# EAGLE design HamPreamp (EAGLE 5.11)
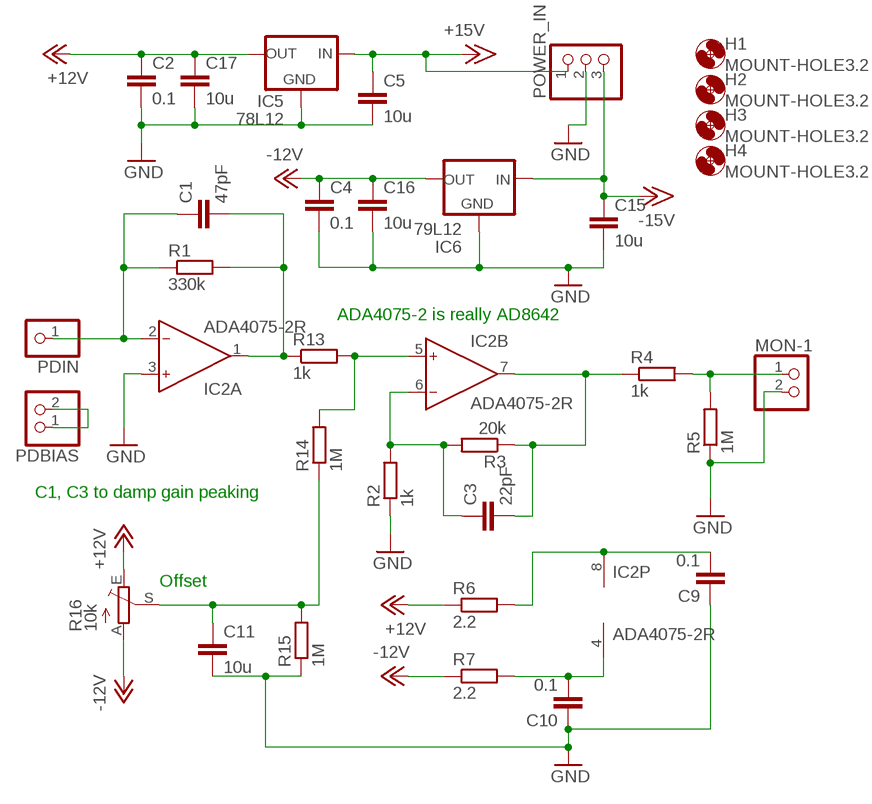
[diagram p0: schematic, sheet 1]

## Parts
C1  47pF  C-EUC0805  [C0805]
C2  0.1  C-EUC1206  [C1206]
C3  22pF  C-EUC0805  [C0805]
C4  0.1  C-EUC1206  [C1206]
C5  10u  C-EUC1206  [C1206]
C9  0.1  C-EUC0805  [C0805]
C10  0.1  C-EUC0805  [C0805]
C11  10u  C-EUC1206  [C1206]
C15  10u  C-EUC1206  [C1206]
C16  10u  C-EUC1206  [C1206]
C17  10u  C-EUC1206  [C1206]
H1  MOUNT-HOLE3.2  [3,2]
H2  MOUNT-HOLE3.2  [3,2]
H3  MOUNT-HOLE3.2  [3,2]
H4  MOUNT-HOLE3.2  [3,2]
IC2  ADA4075-2R  [SO8]
IC5  78L12  78LXX  [78LXX]
IC6  79L12  79LXX  [79LXX]
MON-1  PINHD-1X2  [1X02]
PDBIAS  PINHD-1X2  [1X02]
PDIN  PINHD-1X1  [1X01]
POWER_IN  PINHD-1X3  [1X03]
R1  330k  R-EU_R0805  [R0805]
R2  1k  R-EU_R0805  [R0805]
R3  20k  R-EU_R0805  [R0805]
R4  1k  R-EU_R0805  [R0805]
R5  1M  R-EU_R0805  [R0805]
R6  2.2  R-EU_R0805  [R0805]
R7  2.2  R-EU_R0805  [R0805]
R13  1k  R-EU_R0805  [R0805]
R14  1M  R-EU_R0805  [R0805]
R15  1M  R-EU_R0805  [R0805]
R16  10k  TRIM_EU-S63P  [S63P]

## Nets
+12V: C2.1 C17.1 IC5.OUT R6.1 R16.E
+15V: C5.1 IC5.IN POWER_IN.1
-12V: C4.1 C16.1 IC6.OUT R7.1 R16.A
-15V: C15.1 IC6.IN POWER_IN.3
GND: C2.2 C4.2 C5.2 C9.1 C10.1 C11.2 C15.2 C16.2 C17.2 IC2.3(A:IN+) IC5.GND IC6.GND MON-1.2 POWER_IN.2 R2.1 R5.1 R15.1
N$1: C1.1 IC2.2(A:IN-) PDIN.1 R1.1
N$2: C1.2 IC2.1(A:OUT) R1.2 R13.1
N$3: MON-1.1 R4.2 R5.2
N$4: C10.2 IC2.4(P:V-) R7.2
N$6: C9.2 IC2.8(P:V+) R6.2
N$7: C3.2 IC2.7(B:OUT) R3.1 R4.1
N$10: C11.1 R14.1 R15.2 R16.S
N$11: PDBIAS.1 PDBIAS.2
N$16: IC2.5(B:IN+) R13.2 R14.2
N$17: C3.1 IC2.6(B:IN-) R2.2 R3.2

## Notes on the sheet
- ADA4075-2 is really AD8642
- C1, C3 to damp gain peaking
- Offset

## Library data of the parts
C1-C5 C9-C11 C15-C17 = rcl:C-EU: CAPACITOR, European symbol
H1-H4 = holes:MOUNT-HOLE: MOUNTING HOLE with drill center marker
IC2 = analog-devices:ADA4075-2: Ultralow Noise Amplifier at Lower Power Source: http://www.analog.com/static/imported-files/data_sheets/ADA4075-2.pdf; MPN: ADA4075-2ARZ; OC_FARNELL: 1701254; OC_NEWARK: 19P8164
IC5 = v-reg:78LXX: VOLTAGE REGULATOR
IC6 = v-reg:79LXX: VOLTAGE REGULATOR
MON-1 PDBIAS = pinhead:PINHD-1X2: PIN HEADER
PDIN = pinhead:PINHD-1X1: PIN HEADER
POWER_IN = pinhead:PINHD-1X3: PIN HEADER
R1-R7 R13-R15 = rcl:R-EU_: RESISTOR, European symbol
R16 = pot:TRIM_EU-: POTENTIOMETER

## Board
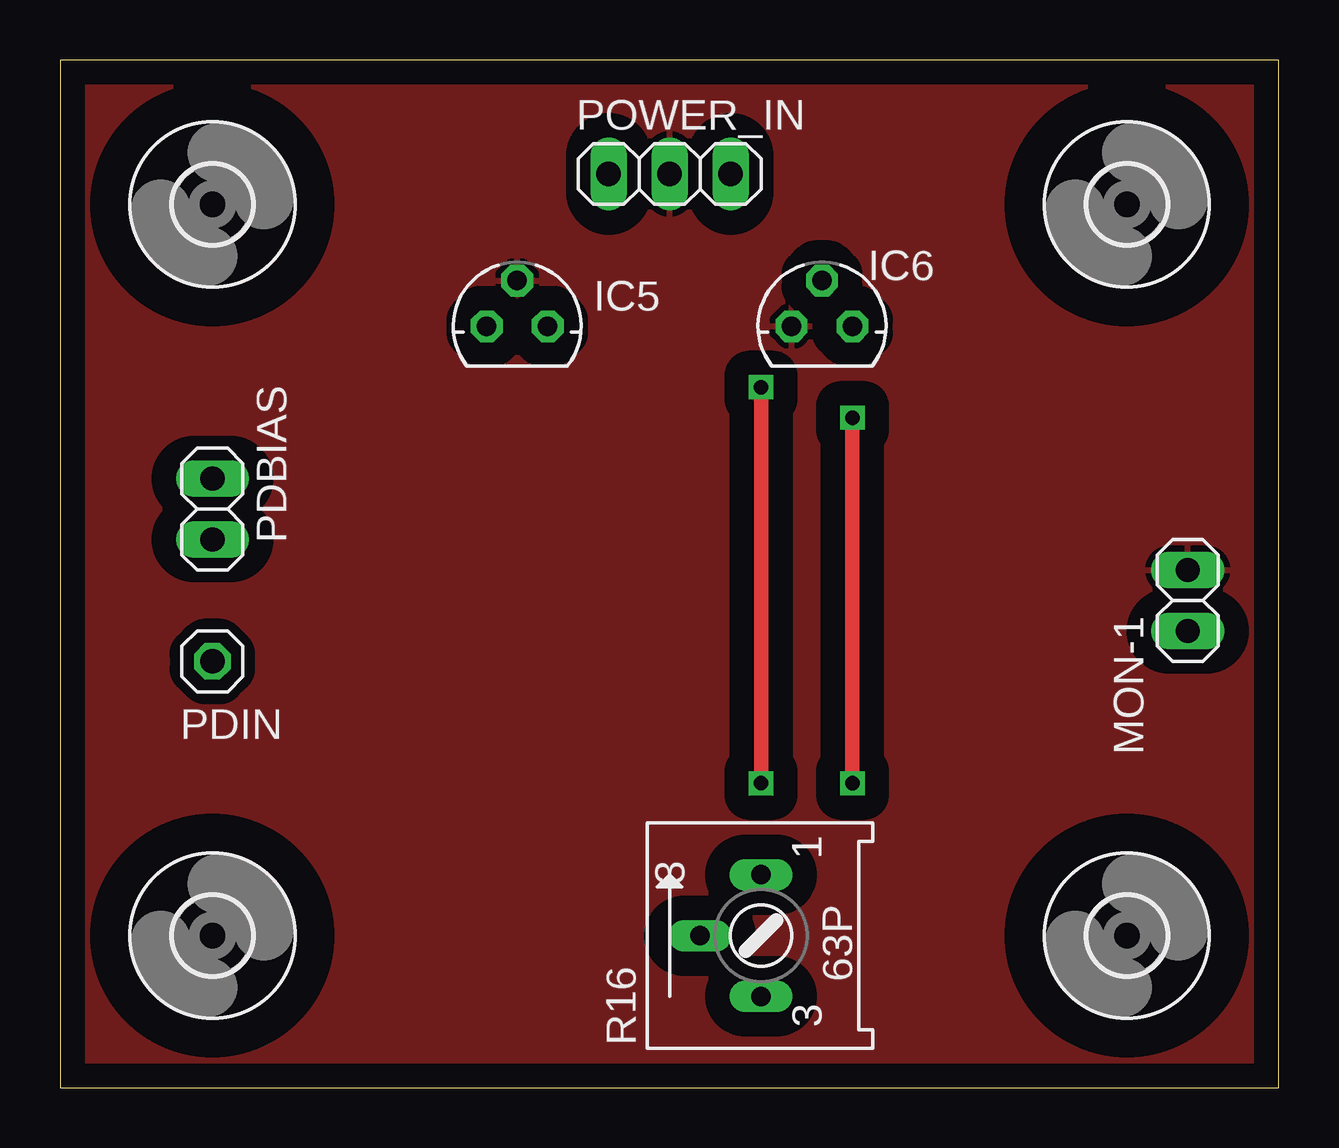
[diagram p1: board, top side]
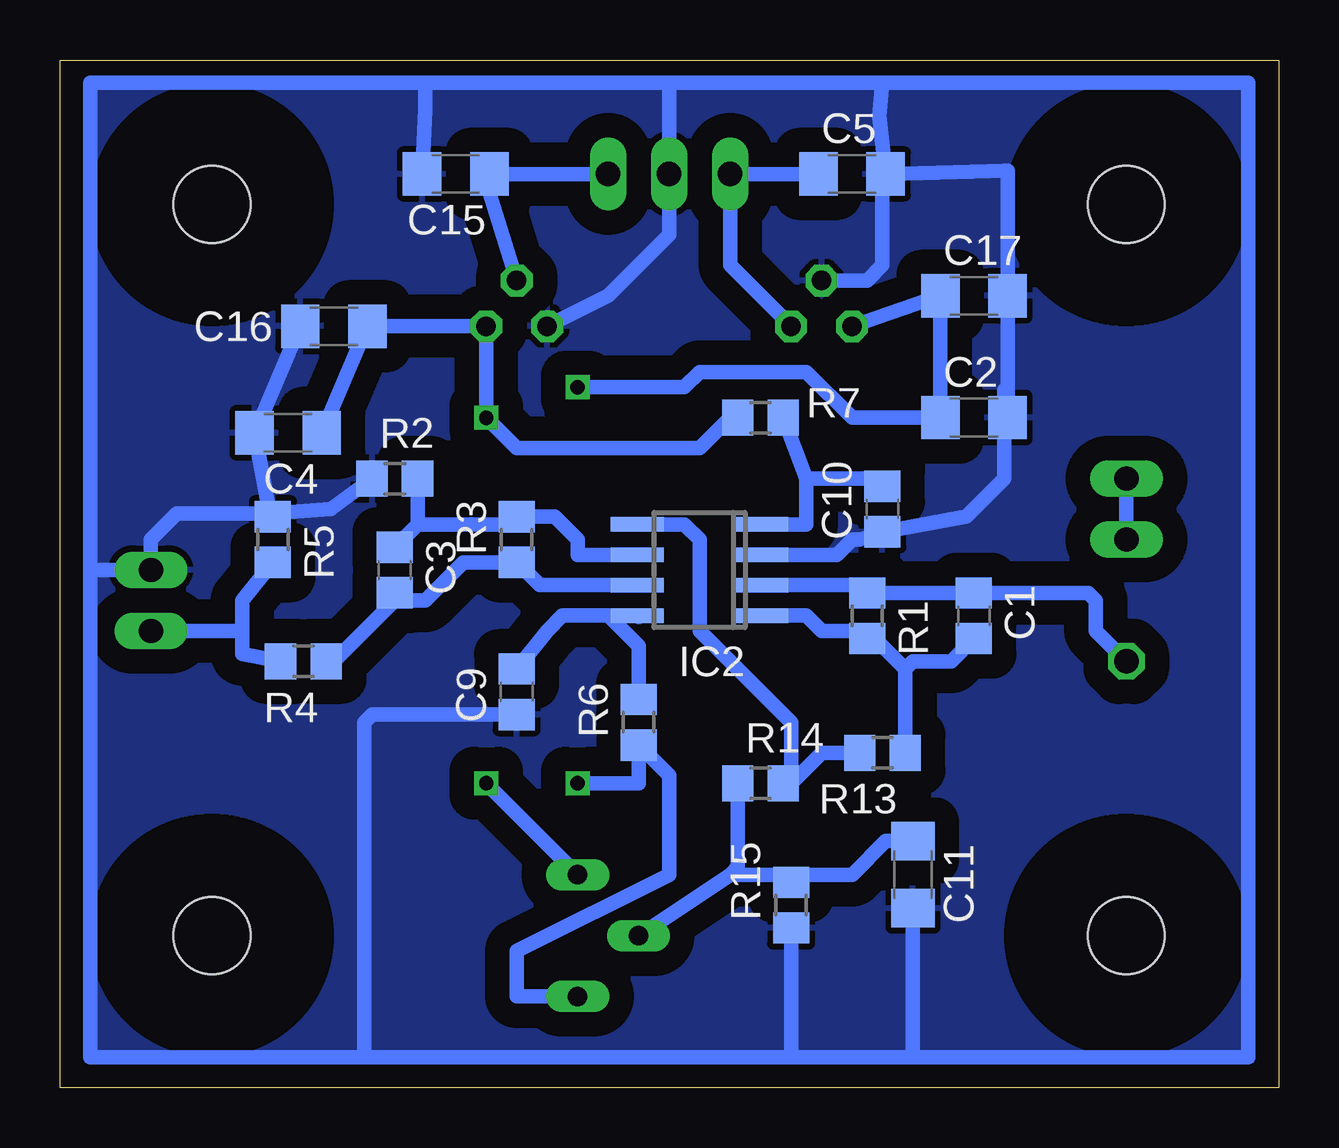
[diagram p2: board, bottom side, seen from below]

Size 50.78 x 42.85 mm. Coordinates in mm from the lower left corner, seen from the top.
Outline: 0,0 50.78,0 50.78,42.85 0,42.85 0,0
Copper layers (1*16): Top 0.035mm / dielectric 1.5mm / Bottom 0.035mm
Design rules "default": minimum track width 10mil, minimum drill 24mil, track to track 8mil, track to pad 8mil, pad to pad 8mil, via to via 8mil, smd to smd 8mil, copper to edge 40mil, drill to drill 8mil, minimum pad ring 10mil, minimum via ring 8mil, stop-mask expansion 4mil, vias tented up to drill 0mil, thermal gap 10mil

### Footprints (pad centres in the part's own frame; a part is rotated, then mirrored left to right if it is on the bottom)
C0805 = smd 1.3 x 1.5: 1 -0.95,0; 2 0.95,0
C1206 = smd 1.6 x 1.8: 1 -1.4,0; 2 1.4,0
3,2 = hole 3.2: 0,0
SO8 = smd 0.6 x 2.2: 1 -1.905,-2.6; 2 -0.635,-2.6; 3 0.635,-2.6; 4 1.905,-2.6; 5 1.905,2.6; 6 0.635,2.6; 7 -0.635,2.6; 8 -1.905,2.6
78LXX = drill 0.813 octagon: GND 0,1.905; IN 1.27,0; OUT -1.27,0
79LXX = drill 0.813 octagon: GND -1.27,0; IN 0,1.905; OUT 1.27,0
1X02 = drill 1.016 long: 1 -1.27,0; 2 1.27,0
1X01 = drill 1.016 octagon: 1 0,0
1X03 = drill 1.016 long: 1 -2.54,0; 2 0,0; 3 2.54,0
R0805 = smd 1.3 x 1.5: 1 -0.95,0; 2 0.95,0
S63P = drill 0.813 long: A 2.54,0; E -2.54,0; S 0,2.54

### Placement (x,y rotation side)
C1  12.7,19.68 270 bottom
C2  12.7,27.94 0 bottom
C3  36.83,21.59 270 bottom
C4  41.27,27.3 180 bottom
C5  17.78,38.1 0 bottom
C9  31.75,16.51 90 bottom
C10  16.51,24.13 90 bottom
C11  15.24,8.89 270 bottom
C15  34.29,38.1 180 bottom
C16  39.37,31.75 180 bottom
C17  12.7,33.02 0 bottom
H1  44.45,6.35 0 top
H2  44.45,36.83 0 top
H3  6.35,6.35 0 top
H4  6.35,36.83 0 top
IC2  24.13,21.59 90 bottom
IC5  19.05,31.75 0 top
IC6  31.75,31.75 0 top
MON-1  46.99,20.32 90 top
PDBIAS  6.35,24.13 270 top
PDIN  6.35,17.78 0 top
POWER_IN  25.4,38.1 0 top
R1  17.14,19.68 270 bottom
R2  36.83,25.4 0 bottom
R3  31.75,22.86 90 bottom
R4  40.64,17.78 180 bottom
R5  41.91,22.86 270 bottom
R6  26.67,15.24 90 bottom
R7  21.59,27.94 0 bottom
R13  16.51,13.97 180 bottom
R14  21.59,12.7 0 bottom
R15  20.32,7.62 90 bottom
R16  29.21,6.35 90 top

### Tracks (layer width: path | path; a pad name or v marks a point on that pad's centre or on a via)
+12V  (via drill 0.6)
  Top 0.61: v29.21,12.7 v29.21,29.21
  Bottom 0.61: IC5.OUT C17.1 C2.1 17.78,27.94 19.68,29.84 24.13,29.84 24.77,29.21 v29.21,29.21 | R16.E 31.75,3.81 31.75,5.71 25.4,8.89 25.4,13.02 R6.1 26.67,12.7 v29.21,12.7
+15V
  Bottom 0.61: IC5.IN 22.86,34.29 POWER_IN.1 C5.1
-12V  (via drill 0.6)
  Top 0.61: v33.02,12.7 v33.02,27.94
  Bottom 0.61: R16.A v33.02,12.7 | C4.1 C16.1 IC6.OUT v33.02,27.94 31.75,26.67 24.13,26.67 22.86,27.94 R7.1
-15V
  Bottom 0.61: POWER_IN.3 C15.1 32.89,37.34 IC6.IN
GND
  Bottom 0.61: 25.4,41.91 POWER_IN.2 25.4,35.56 27.94,33.02 IC6.GND | 16.51,41.91 1.27,41.91 1.27,1.27 15.24,1.27 | 16.51,41.91 25.4,41.91 | 15.24,1.27 C11.2 | 15.24,1.27 20.32,1.27 | 20.32,1.27 38.1,1.27 | 38.1,1.27 38.1,15.24 37.78,15.56 C9.1 | 38.1,1.27 49.53,1.27 49.53,21.59 | 49.53,21.59 MON-1.2 46.99,22.86 45.91,23.94 42.04,23.94 | 49.53,21.59 49.53,41.91 35.56,41.91 | 35.56,41.91 35.56,40.77 C15.2 | 25.4,41.91 35.56,41.91 | C5.2 16.64,40.51 16.51,41.91 | 20.32,1.27 R15.1 | IC2.3 18.41,22.23 17.78,22.86 17.46,22.86 C10.1 13.02,23.82 11.43,25.4 11.43,29.08 C2.2 C17.2 11.3,38.09 11.43,38.23 | C5.2 11.43,38.23 | 11.43,38.23 11.3,38.23 | 11.3,38.23 16.51,38.1 | 11.3,38.23 16.25,38.1 | C16.2 C4.2 42.04,23.94 | 42.04,23.94 39.5,24.13 R2.1 | IC5.GND 17.14,33.66 16.51,34.29 16.51,37.97 C5.2 | 42.04,23.94 R5.1
  pour Bottom (isolate 1.016): 0.64,0.64 0.64,42.55 50.16,42.55 50.16,0.64
  pour Top (isolate 1.016): 0.64,0.64 0.64,41.91 50.16,41.91 50.16,0.64
N$1
  Bottom 0.61: IC2.2 17.46,20.95 R1.1 C1.1 7.94,20.64 7.62,20.32 7.62,19.05 PDIN.1
N$2
  Bottom 0.61: IC2.1 19.68,19.68 19.05,19.05 17.46,19.05 R1.2 16.84,18.73 15.56,17.46 | R13.1 15.56,17.46 | 15.56,17.46 15.24,17.78 13.66,17.78 C1.2
N$3
  Bottom 0.61: R5.2 43.18,20.32 43.18,19.05 | 43.18,19.05 43.18,18.1 R4.2 | 43.18,19.05 MON-1.1
N$4
  Bottom 0.61: IC2.4 19.68,23.5 19.68,25.4 | 19.68,25.4 16.82,25.4 C10.2 | 19.68,25.4 R7.2
N$6
  Bottom 0.61: 27.94,19.68 IC2.8 26.67,19.62 | 27.94,19.68 29.84,19.68 30.48,19.05 C9.2 | R6.2 26.67,18.41 27.94,19.68
N$7
  Bottom 0.61: IC2.7 30.79,20.95 R3.1 33.97,21.91 35.56,20.32 36.51,20.32 C3.2 36.83,20.32 39.37,17.78 R4.1
N$10
  Bottom 0.61: C11.1 16.38,10.29 17.78,8.89 20,8.89 R15.2 20.64,8.89 22.86,8.89 | 22.86,8.89 R16.S | R14.1 22.54,9.21 22.86,8.89
N$11
  Bottom 0.61: PDBIAS.2 PDBIAS.1
N$16
  Bottom 0.61: R13.2 19.05,13.97 20.32,12.7 R14.2 20.32,13.02 20.32,15.24 24.13,19.05 24.13,22.86 24.77,23.5 IC2.5
N$17
  Bottom 0.61: 35.88,23.49 R2.2 | 35.88,23.49 C3.1 | 35.88,23.49 32.07,23.49 R3.2 30.16,23.81 29.21,22.86 29.21,22.23 IC2.6